# EAGLE schematic Non_Inverting_0603 (EAGLE 7.5.0)
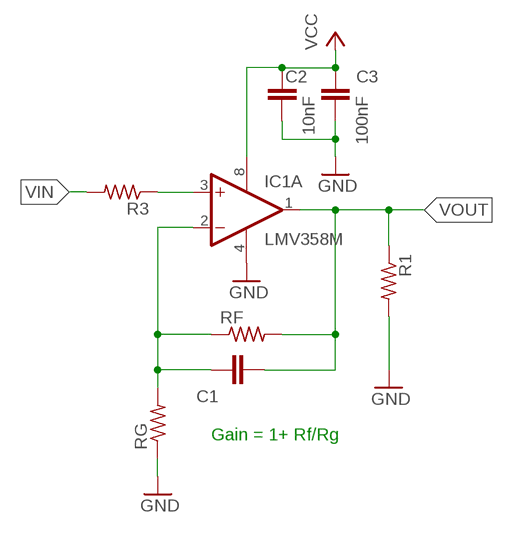
[diagram p0: schematic, sheet 1]

## Parts
C1  C-EUC0603  [C0603]
C2  10nF  C-EUC0603  [C0603]
C3  100nF  C-EUC0603  [C0603]
IC1  LMV358M  [SO08]
R1  R-US_R0603  [R0603]
R3  R-US_R0603  [R0603]
RF  R-US_R0603  [R0603]
RG  R-US_R0603  [R0603]

## Nets
GND: C2.1 C3.1 IC1.4(P:V-) R1.2 RG.1
N$1: C1.1 IC1.2(A:-IN) RF.1 RG.2
N$3: IC1.3(A:+IN) R3.1
VCC: C2.2 C3.2 IC1.8(P:V+)
VIN: R3.2
VOUT: C1.2 IC1.1(A:OUT) R1.1 RF.2
Unconnected: IC1.5(B:+IN) IC1.6(B:-IN) IC1.7(B:OUT)

## Notes on the sheet
- Gain = 1+ Rf/Rg

## Library data of the parts
C1-C3 = rcl:C-EU: CAPACITOR, European symbol
IC1 = linear:LMV358?*: Dual General Purpose, Low Voltage, Rail-to-Rail Output Operational Amplifiers Source: http://www.national.com/mpf/LM/LMV321.html http://www.national.com/dt/lmv_qual.pdf
R1 R3 RF RG = rcl:R-US_: RESISTOR, American symbol